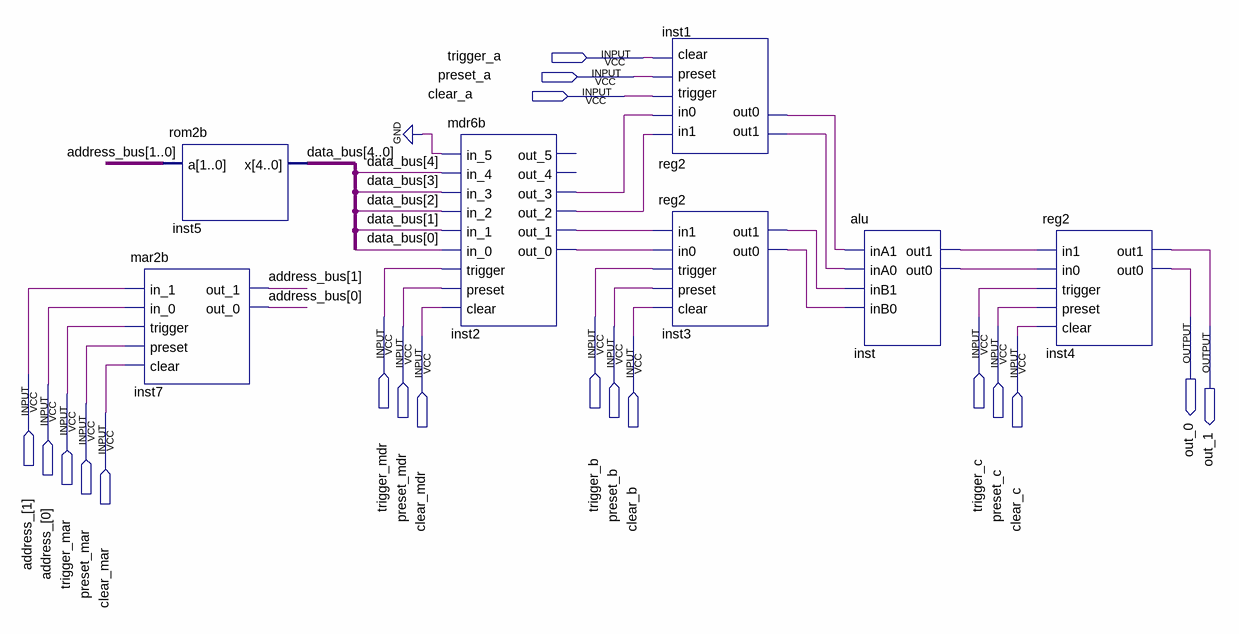
[diagram p0: schematic sheet]
// Quartus schematic fcta.bdf as structural Verilog: 7 symbols, 19 pins
module fcta (
  input  trigger_a,
  input  preset_a,
  input  clear_a,
  input  trigger_mdr,
  input  trigger_b,
  input  trigger_c,
  input  preset_mdr,
  input  preset_b,
  input  preset_c,
  input  clear_mdr,
  input  clear_b,
  input  clear_c,
  input  [1:0] address_,
  input  trigger_mar,
  input  preset_mar,
  input  clear_mar,
  output out_0,
  output out_1
);

  wire inst1_out0, inst1_out1, inst2_out_0, inst2_out_1, inst2_out_2, inst2_out_3, inst3_out0, inst3_out1,
       inst_out0, inst_out1;
  wire [1:0] address_bus;
  wire [4:0] data_bus;

  mar2b inst7 (
    .in_1(address_[1]), .in_0(address_[0]), .trigger(trigger_mar), .preset(preset_mar), .clear(clear_mar),
    .out_1(address_bus[1]), .out_0(address_bus[0]));
  rom2b inst5 (.a(address_bus), .x(data_bus));
  mdr6b inst2 (
    .in_5(1'b0), .in_4(data_bus[4]), .in_3(data_bus[3]), .in_2(data_bus[2]), .in_1(data_bus[1]),
    .in_0(data_bus[0]), .trigger(trigger_mdr), .preset(preset_mdr), .clear(clear_mdr), .out_3(inst2_out_3),
    .out_2(inst2_out_2), .out_1(inst2_out_1), .out_0(inst2_out_0));  // open: out_5, out_4
  reg2 inst1 (
    .in1(inst2_out_2), .in0(inst2_out_3), .trigger(clear_a), .preset(preset_a), .clear(trigger_a),
    .out1(inst1_out1), .out0(inst1_out0));
  reg2 inst3 (
    .in1(inst2_out_1), .in0(inst2_out_0), .trigger(trigger_b), .preset(preset_b), .clear(clear_b),
    .out1(inst3_out1), .out0(inst3_out0));
  alu inst (
    .inA1(inst1_out0), .inA0(inst1_out1), .inB1(inst3_out1), .inB0(inst3_out0), .out1(inst_out1),
    .out0(inst_out0));
  reg2 inst4 (
    .in1(inst_out1), .in0(inst_out0), .trigger(trigger_c), .preset(preset_c), .clear(clear_c), .out1(out_1),
    .out0(out_0));
endmodule
